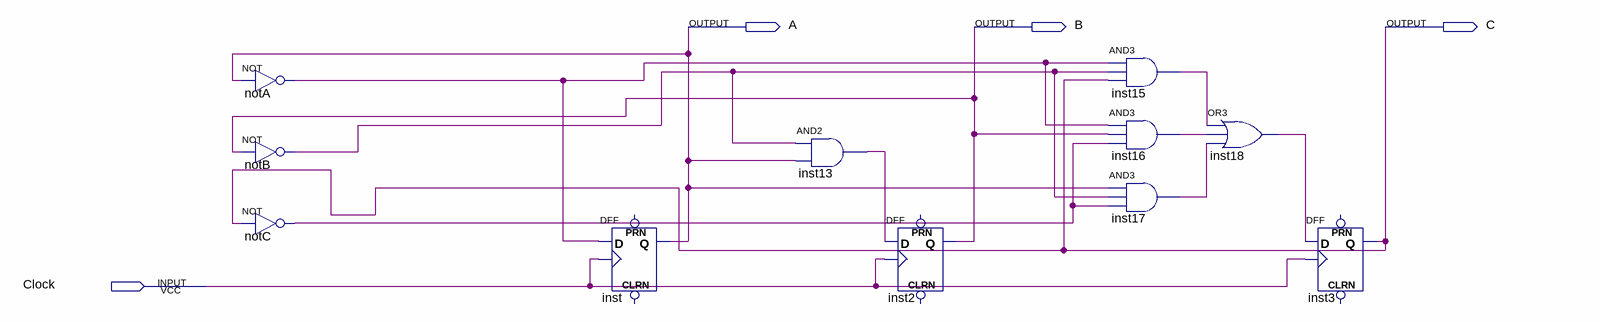
[diagram p0: schematic sheet]
// Quartus schematic proj1.bdf as structural Verilog: 11 symbols, 4 pins
module proj1 (
  input  Clock,
  output A,
  output B,
  output C
);

  wire inst13_out, inst15_out, inst16_out, inst17_out, inst18_out, notA_out, notB_out, notC_out;

  not notA (notA_out, A);
  not notB (notB_out, B);
  not notC (notC_out, C);
  DFF inst (.CLK(Clock), .D(notA_out), .Q(A));  // open: CLRN, PRN
  and inst13 (inst13_out, notB_out, A);
  DFF inst2 (.CLK(Clock), .D(inst13_out), .Q(B));  // open: CLRN, PRN
  and inst15 (inst15_out, notA_out, notB_out, C);
  and inst16 (inst16_out, notA_out, B, notC_out);
  and inst17 (inst17_out, A, notB_out, notC_out);
  or inst18 (inst18_out, inst15_out, inst16_out, inst17_out);
  DFF inst3 (.CLK(Clock), .D(inst18_out), .Q(C));  // open: CLRN, PRN
endmodule
